# Altium schematic sheet DUAL PROTECTED INPUT.SchDoc
size B
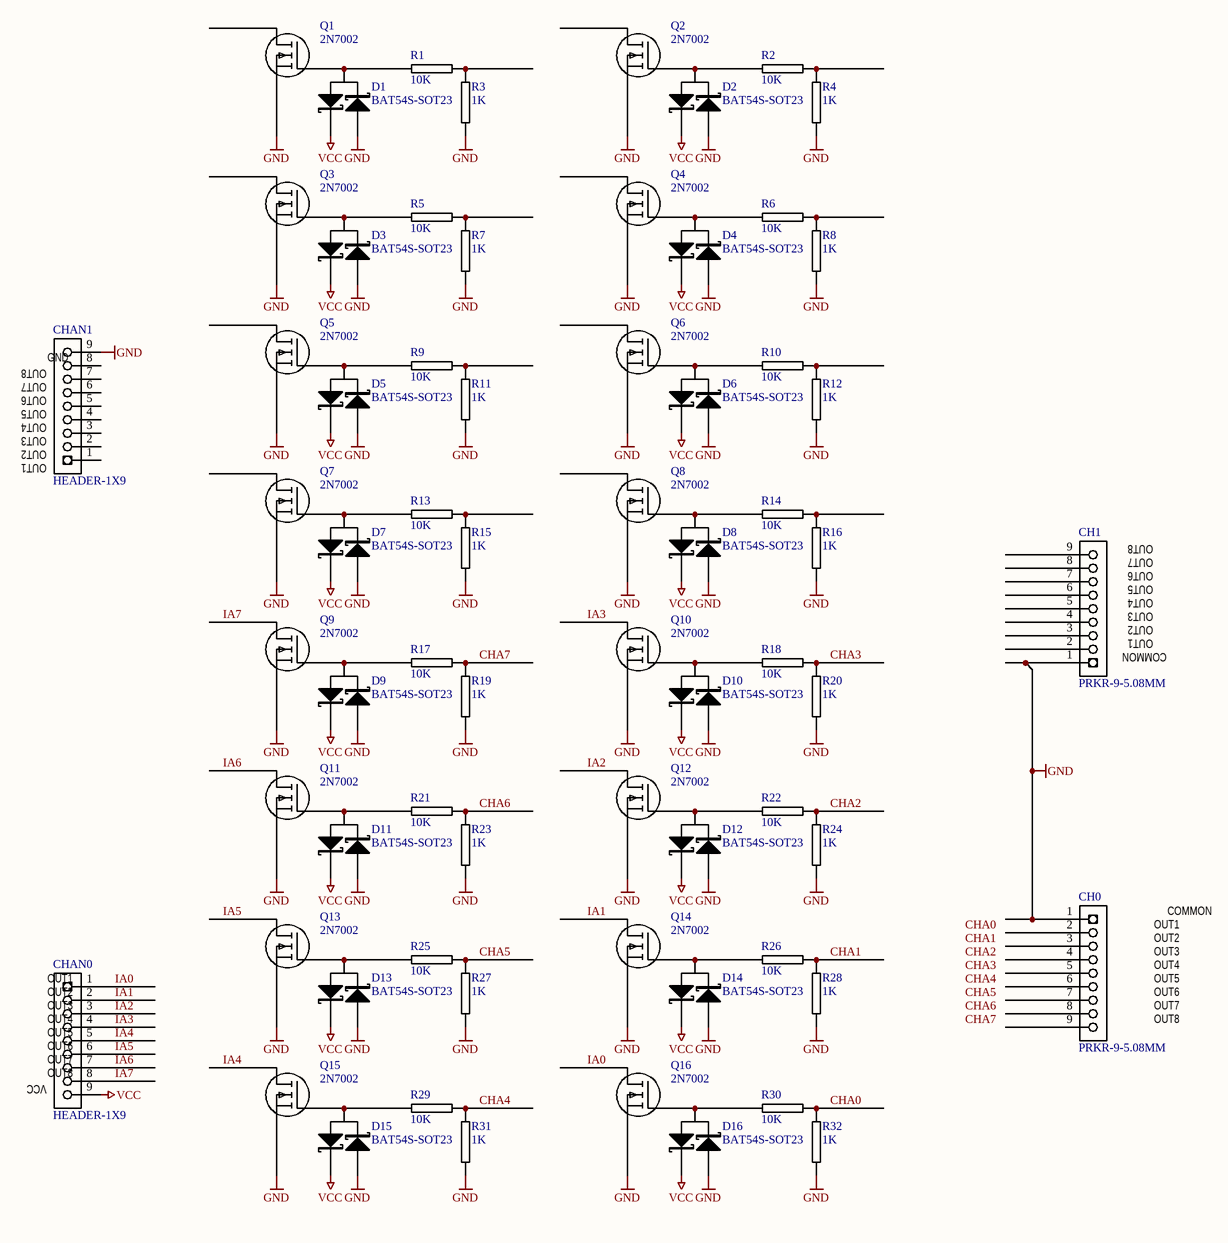
[diagram p0: DUAL PROTECTED INPUT.SchDoc]

## Parts
CH0  PRKR-9-5.08MM  [PRKR-9-5.08MM]
CH1  PRKR-9-5.08MM  [PRKR-9-5.08MM]
CHAN0  HEADER-1X9  [HEADER-1X9]
CHAN1  HEADER-1X9  [HEADER-1X9]
D1  BAT54S-SOT23  [SOT23-123]
D2  BAT54S-SOT23  [SOT23-123]
D3  BAT54S-SOT23  [SOT23-123]
D4  BAT54S-SOT23  [SOT23-123]
D5  BAT54S-SOT23  [SOT23-123]
D6  BAT54S-SOT23  [SOT23-123]
D7  BAT54S-SOT23  [SOT23-123]
D8  BAT54S-SOT23  [SOT23-123]
D9  BAT54S-SOT23  [SOT23-123]
D10  BAT54S-SOT23  [SOT23-123]
D11  BAT54S-SOT23  [SOT23-123]
D12  BAT54S-SOT23  [SOT23-123]
D13  BAT54S-SOT23  [SOT23-123]
D14  BAT54S-SOT23  [SOT23-123]
D15  BAT54S-SOT23  [SOT23-123]
D16  BAT54S-SOT23  [SOT23-123]
Q1  2N7002  [SOT23-GDS]
Q2  2N7002  [SOT23-GDS]
Q3  2N7002  [SOT23-GDS]
Q4  2N7002  [SOT23-GDS]
Q5  2N7002  [SOT23-GDS]
Q6  2N7002  [SOT23-GDS]
Q7  2N7002  [SOT23-GDS]
Q8  2N7002  [SOT23-GDS]
Q9  2N7002  [SOT23-GDS]
Q10  2N7002  [SOT23-GDS]
Q11  2N7002  [SOT23-GDS]
Q12  2N7002  [SOT23-GDS]
Q13  2N7002  [SOT23-GDS]
Q14  2N7002  [SOT23-GDS]
Q15  2N7002  [SOT23-GDS]
Q16  2N7002  [SOT23-GDS]
R1  10K  [0805R-10K]
R2  10K  [0805R-10K]
R3  1K  [0805R-1K]
R4  1K  [0805R-1K]
R5  10K  [0805R-10K]
R6  10K  [0805R-10K]
R7  1K  [0805R-1K]
R8  1K  [0805R-1K]
R9  10K  [0805R-10K]
R10  10K  [0805R-10K]
R11  1K  [0805R-1K]
R12  1K  [0805R-1K]
R13  10K  [0805R-10K]
R14  10K  [0805R-10K]
R15  1K  [0805R-1K]
R16  1K  [0805R-1K]
R17  10K  [0805R-10K]
R18  10K  [0805R-10K]
R19  1K  [0805R-1K]
R20  1K  [0805R-1K]
R21  10K  [0805R-10K]
R22  10K  [0805R-10K]
R23  1K  [0805R-1K]
R24  1K  [0805R-1K]
R25  10K  [0805R-10K]
R26  10K  [0805R-10K]
R27  1K  [0805R-1K]
R28  1K  [0805R-1K]
R29  10K  [0805R-10K]
R30  10K  [0805R-10K]
R31  1K  [0805R-1K]
R32  1K  [0805R-1K]

## Nets
GND: CH0.1 CH1.1 CHAN1.9 D1.1 D2.1 D3.1 D4.1 D5.1 D6.1 D7.1 D8.1 D9.1 D10.1 D11.1 D12.1 D13.1 D14.1 D15.1 D16.1 Q1.S Q2.S Q3.S Q4.S Q5.S Q6.S Q7.S Q8.S Q9.S Q10.S Q11.S Q12.S Q13.S Q14.S Q15.S Q16.S R3.2 R4.2 R7.2 R8.2 R11.2 R12.2 R15.2 R16.2 R19.2 R20.2 R23.2 R24.2 R27.2 R28.2 R31.2 R32.2
VCC: CHAN0.9 D1.2 D2.2 D3.2 D4.2 D5.2 D6.2 D7.2 D8.2 D9.2 D10.2 D11.2 D12.2 D13.2 D14.2 D15.2 D16.2
CHA0: R30.2 R32.1
CHA1: R26.2 R28.1
CHA2: R22.2 R24.1
CHA3: R18.2 R20.1
CHA4: R29.2 R31.1
CHA5: R25.2 R27.1
CHA6: R21.2 R23.1
CHA7: R17.2 R19.1
IA0: CHAN0.1 Q16.D
IA1: CHAN0.2 Q14.D
IA2: CHAN0.3 Q12.D
IA3: CHAN0.4 Q10.D
IA4: CHAN0.5 Q15.D
IA5: CHAN0.6 Q13.D
IA6: CHAN0.7 Q11.D
IA7: CHAN0.8 Q9.D
NetD1_3: D1.3 Q1.G R1.1
NetD2_3: D2.3 Q2.G R2.1
NetD3_3: D3.3 Q3.G R5.1
NetD4_3: D4.3 Q4.G R6.1
NetD5_3: D5.3 Q5.G R9.1
NetD6_3: D6.3 Q6.G R10.1
NetD7_3: D7.3 Q7.G R13.1
NetD8_3: D8.3 Q8.G R14.1
NetD9_3: D9.3 Q9.G R17.1
NetD10_3: D10.3 Q10.G R18.1
NetD11_3: D11.3 Q11.G R21.1
NetD12_3: D12.3 Q12.G R22.1
NetD13_3: D13.3 Q13.G R25.1
NetD14_3: D14.3 Q14.G R26.1
NetD15_3: D15.3 Q15.G R29.1
NetD16_3: D16.3 Q16.G R30.1
NetR1_2: R1.2 R3.1
NetR2_2: R2.2 R4.1
NetR5_2: R5.2 R7.1
NetR6_2: R6.2 R8.1
NetR9_2: R9.2 R11.1
NetR10_2: R10.2 R12.1
NetR13_2: R13.2 R15.1
NetR14_2: R14.2 R16.1

Not connected (* = marked no-connect by the designer): CH0 2 3 4 5 6 7 8 9; CH1 2 3 4 5 6 7 8 9; CHAN1 1 2 3 4 5 6 7 8; Q1 D; Q2 D; Q3 D; Q4 D; Q5 D; Q6 D; Q7 D; Q8 D

## Notes on the sheet
- (near CHAN1) GND
- (near CHAN1) OUT4
- (near CHAN1) OUT5
- (near CHAN1) OUT6
- (near CHAN1) OUT7
- (near CHAN1) OUT8
- (near CHAN1) OUT1
- (near CHAN1) OUT2
- (near CHAN1) OUT3
- (near CH1) OUT7
- (near CH1) OUT8
- (near CH1) OUT2
- (near CH1) OUT3
- (near CH1) OUT4
- (near CH1) OUT5
- (near CH1) OUT6
- (near CH1) OUT1
- (near CH1) COMMON
- (near CH0) OUT1
- (near CH0) OUT2
- (near CH0) OUT3
- (near CH0) COMMON
- (near CHAN0) OUT1
- (near CHAN0) OUT2
- (near CHAN0) OUT3
- (near CHAN0) OUT4
- (near CH0) OUT4
- (near CH0) OUT5
- (near CH0) OUT6
- (near CH0) OUT7
- (near CH0) OUT8
- (near CHAN0) VCC
- (near CHAN0) OUT5
- (near CHAN0) OUT6
- (near CHAN0) OUT7
- (near CHAN0) OUT8
- Labels drawn without touching a wire or pin: CHA0, CHA1, CHA2, CHA3, CHA4, CHA5, CHA6, CHA7

## Library data of the parts
D1-D16 = BAT54S-SOT23: DUAL SCHOTTKY DIODE SERIES; Manufacturer Part Number: BAT54S,215; Manufacturer: NXP Semiconductors; Voltage - DC Reverse (Vr) (Max): 30V; Speed: Small Signal =< 200mA (Io), Any Speed; Current - Reverse Leakage @ Vr: 2µA @ 25V; Diode Configuration: 1 Pair Series Connection; Voltage - Forward (Vf) (Max) @ If: 800mV @ 100mA; Current - Average Rectified (Io) (per Diode): 200mA (DC); Reverse Recovery Time (trr): 5ns; Description: DIODE SCHOTTKY 30V DUAL SOT23; Supplier 1: Digi-Key; Supplier Part Number 1: 568-1614-1-ND; Diode Type: Schottky; Package / Case: SOT-23-3, TO-236-3, Micro3™, SSD3, SST3; Packaging: Cut Tape (CT); Mounting Type: Surface Mount; Supplier Part Number: 568-1614-1-ND; RoHS: RoHS Compliant; Supplier: Digi-Key; Category: Discrete Semiconductor Products
Q1-Q16 = 2N7002-SOT23: N CHANNEL MOSFET 2N7002 SOT23; Manufacturer: Fairchild Semiconductor; Drain to Source Voltage (Vdss): 60V; Vgs(th) (Max) @ Id: 2.5V @ 250µA; Power - Max: 200mW; Current - Continuous Drain (Id) @ 25° C: 115mA; Rds On (Max) @ Id, Vgs: 7.5 Ohm @ 500mA, 10V; FET Type: MOSFET N-Channel, Metal Oxide; FET Feature: Logic Level Gate; Input Capacitance (Ciss) @ Vds: 50pF @ 25V; Description: MOSFET N-CH 60V 115MA SOT-23; Reel: Q2; Supplier 1: Digi-Key; Supplier Part Number 1: 2N7002NTR-ND; Package / Case: SOT-23-3, TO-236-3, Micro3™, SSD3, SST3; RoHS: RoHS Compliant; Mounting Type: Surface Mount; Packaging: Tape & Reel (TR); Gate Charge (Qg) @ Vgs: -; Supplier Part Number: 2N7002NTR-ND; Supplier: Digi-Key; Category: Discrete Semiconductor Products; Manufacturer Part Number: 2N7002
R1 R2 R5 R6 R9 R10 R13 R14 R17 R18 R21 R22 R25 R26 R29 R30 = 0805R-10K: RESISTOR 0805 1/4 WATT THIN FILM; Reel: *
R3 R4 R7 R8 R11 R12 R15 R16 R19 R20 R23 R24 R27 R28 R31 R32 = 0805R-1K: RESISTOR 0805 1/4 WATT THIN FILM; Reel: *
CH0 CH1 = PRKR-9-5.08MM: Supplier 1: Digi-Key; Supplier Part Number 1: S1011E-36-ND
CHAN0 CHAN1 = HEADER-1X9: Supplier 1: Digi-Key; Supplier Part Number 1: S1011E-36-ND